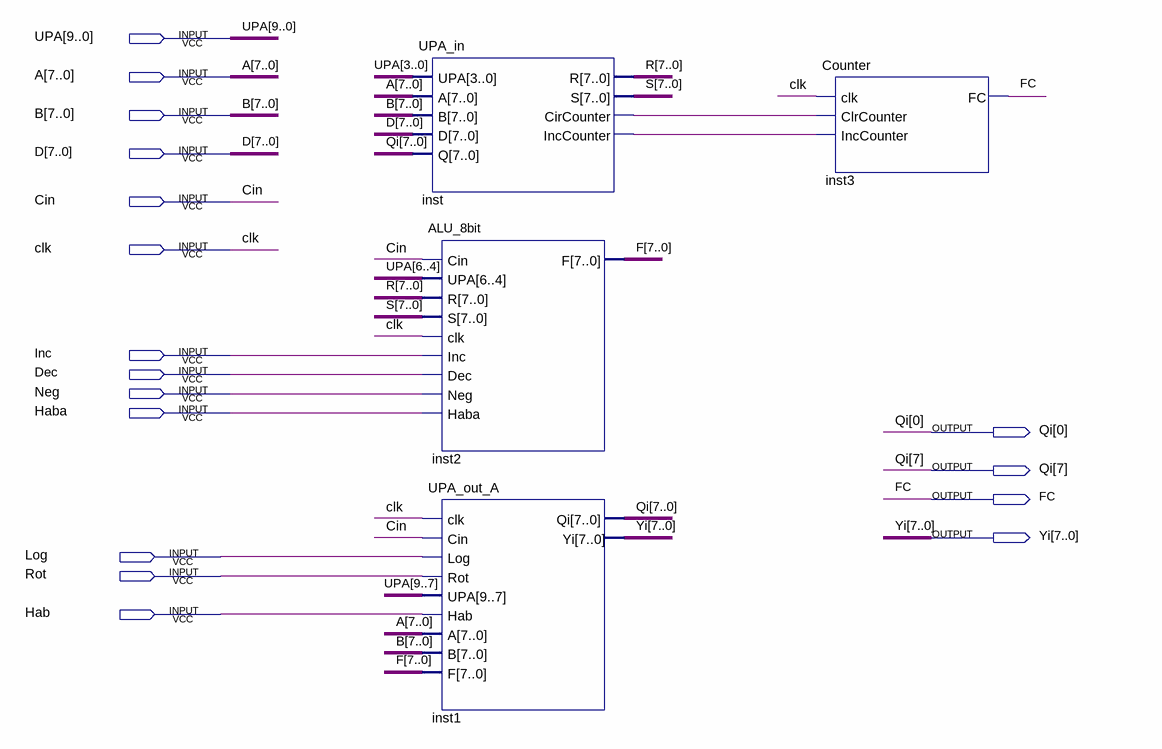
[diagram p0: schematic sheet]
// Quartus schematic UPA.bdf as structural Verilog: 4 symbols, 17 pins
module UPA (
  input  [9:0] UPA,
  input  [7:0] A,
  input  [7:0] B,
  input  [7:0] D,
  input  Cin,
  input  clk,
  input  Inc,
  input  Dec,
  input  Neg,
  input  Haba,
  input  Log,
  input  Rot,
  input  Hab,
  output [7:0] Qi,
  output FC,
  output [7:0] Yi
);

  wire inst_circounter, inst_inccounter;
  wire [7:0] F, R, S;

  UPA_in inst (
    .UPA(UPA[3:0]), .A(A), .B(B), .D(D), .Q(Qi), .R(R), .S(S), .CirCounter(inst_circounter),
    .IncCounter(inst_inccounter));
  ALU_8bit inst2 (
    .Cin(Cin), .UPA(UPA[6:4]), .R(R), .S(S), .clk(clk), .Inc(Inc), .Dec(Dec), .Neg(Neg), .Haba(Haba), .F(F));
  UPA_out_A inst1 (
    .clk(clk), .Cin(Cin), .Log(Log), .Rot(Rot), .UPA(UPA[9:7]), .Hab(Hab), .A(A), .B(B), .F(F), .Qi(Qi),
    .Yi(Yi));
  Counter inst3 (.clk(clk), .ClrCounter(inst_circounter), .IncCounter(inst_inccounter), .FC(FC));
endmodule
